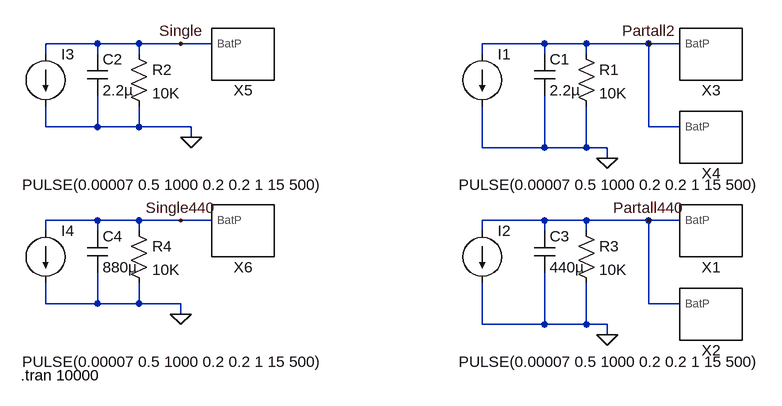
[diagram p0: schematic Battery Config.asc]
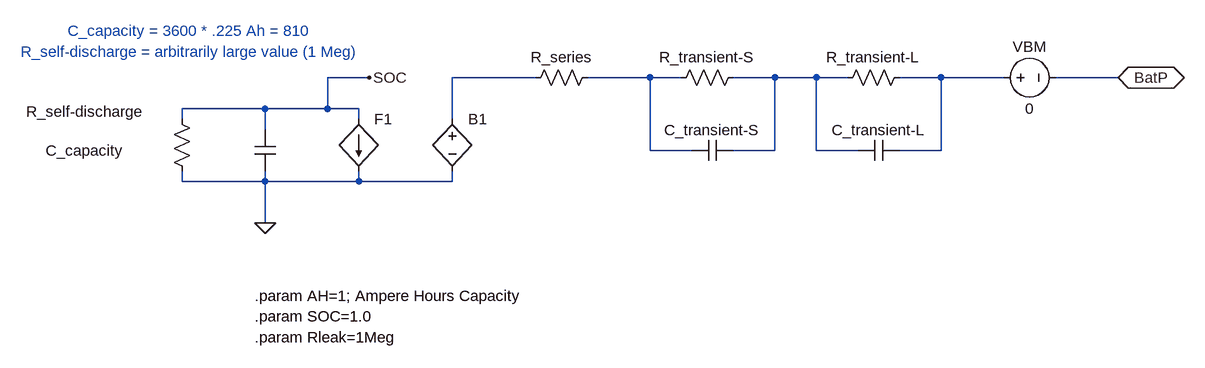
[diagram p1: sub-circuit li-battery_cr2032.asc]
Battery Config.asc, the LTspice schematic file:
Version 4
SHEET 1 1124 680
WIRE -208 96 -288 96
WIRE -144 96 -208 96
WIRE -80 96 -144 96
WIRE -32 96 -80 96
WIRE 480 96 384 96
WIRE 544 96 480 96
WIRE 640 96 544 96
WIRE 688 96 640 96
WIRE -288 112 -288 96
WIRE -208 112 -208 96
WIRE -144 112 -144 96
WIRE 384 112 384 96
WIRE 480 112 480 96
WIRE 544 112 544 96
WIRE -288 224 -288 192
WIRE -208 224 -208 176
WIRE -208 224 -288 224
WIRE -144 224 -144 192
WIRE -144 224 -208 224
WIRE -64 224 -144 224
WIRE 640 224 640 96
WIRE 688 224 640 224
WIRE -64 240 -64 224
WIRE 384 256 384 192
WIRE 480 256 480 176
WIRE 480 256 384 256
WIRE 544 256 544 192
WIRE 544 256 480 256
WIRE 576 256 544 256
WIRE 576 272 576 256
WIRE -208 368 -288 368
WIRE -144 368 -208 368
WIRE -80 368 -144 368
WIRE -32 368 -80 368
WIRE 480 368 384 368
WIRE 544 368 480 368
WIRE 640 368 544 368
WIRE 688 368 640 368
WIRE -288 384 -288 368
WIRE -208 384 -208 368
WIRE -144 384 -144 368
WIRE 384 384 384 368
WIRE 480 384 480 368
WIRE 544 384 544 368
WIRE -288 496 -288 464
WIRE -208 496 -208 448
WIRE -208 496 -288 496
WIRE -144 496 -144 464
WIRE -144 496 -208 496
WIRE -80 496 -144 496
WIRE 640 496 640 368
WIRE 688 496 640 496
WIRE -80 512 -80 496
WIRE 384 528 384 464
WIRE 480 528 480 448
WIRE 480 528 384 528
WIRE 544 528 544 464
WIRE 544 528 480 528
WIRE 576 528 544 528
WIRE 576 544 576 528
FLAG 640 96 Partall2
FLAG -80 96 Single
FLAG 640 368 Partall440
FLAG -80 368 Single440
FLAG -80 512 0
FLAG -64 240 0
FLAG 576 272 0
FLAG 576 544 0
SYMBOL Li-battery_CR2032 736 112 R180
SYMATTR InstName X3
SYMBOL Li-battery_CR2032 736 240 R180
SYMATTR InstName X4
SYMBOL Li-battery_CR2032 16 112 R180
SYMATTR InstName X5
SYMBOL load2 384 112 R0
WINDOW 3 -36 201 Left 2
WINDOW 123 0 0 Left 0
WINDOW 39 0 0 Left 0
SYMATTR InstName I1
SYMATTR Value PULSE(0.00007 0.5 1000 0.2 0.2 1 15 500)
SYMBOL res 528 96 R0
SYMATTR InstName R1
SYMATTR Value 10K
SYMBOL cap 464 112 R0
SYMATTR InstName C1
SYMATTR Value 2.2µ
SYMBOL cap -224 112 R0
SYMATTR InstName C2
SYMATTR Value 2.2µ
SYMBOL res -160 96 R0
SYMATTR InstName R2
SYMATTR Value 10K
SYMBOL Li-battery_CR2032 736 384 R180
SYMATTR InstName X1
SYMBOL Li-battery_CR2032 736 512 R180
SYMATTR InstName X2
SYMBOL load2 384 384 R0
WINDOW 3 -36 201 Left 2
WINDOW 123 0 0 Left 0
WINDOW 39 0 0 Left 0
SYMATTR InstName I2
SYMATTR Value PULSE(0.00007 0.5 1000 0.2 0.2 1 15 500)
SYMBOL res 528 368 R0
SYMATTR InstName R3
SYMATTR Value 10K
SYMBOL cap 464 384 R0
SYMATTR InstName C3
SYMATTR Value 440µ
SYMBOL load2 -288 112 R0
WINDOW 3 -36 201 Left 2
WINDOW 123 0 0 Left 0
WINDOW 39 0 0 Left 0
SYMATTR InstName I3
SYMATTR Value PULSE(0.00007 0.5 1000 0.2 0.2 1 15 500)
SYMBOL Li-battery_CR2032 16 384 R180
SYMATTR InstName X6
SYMBOL cap -224 384 R0
SYMATTR InstName C4
SYMATTR Value 880µ
SYMBOL res -160 368 R0
SYMATTR InstName R4
SYMATTR Value 10K
SYMBOL load2 -288 384 R0
WINDOW 3 -36 201 Left 2
WINDOW 123 0 0 Left 0
WINDOW 39 0 0 Left 0
SYMATTR InstName I4
SYMATTR Value PULSE(0.00007 0.5 1000 0.2 0.2 1 15 500)
TEXT -326 606 Left 2 !.tran 10000

li-battery_cr2032.asc, the sub-circuit schematic file:
Version 4
SHEET 1 1596 680
WIRE 192 48 128 48
WIRE 448 48 320 48
WIRE 624 48 528 48
WIRE 672 48 624 48
WIRE 816 48 752 48
WIRE 880 48 816 48
WIRE 928 48 880 48
WIRE 1072 48 1008 48
WIRE 1168 48 1072 48
WIRE 1344 48 1248 48
WIRE 32 96 -96 96
WIRE 128 96 128 48
WIRE 128 96 32 96
WIRE 176 96 128 96
WIRE -96 112 -96 96
WIRE 176 112 176 96
WIRE 320 112 320 48
WIRE 32 128 32 96
WIRE 624 160 624 48
WIRE 688 160 624 160
WIRE 816 160 816 48
WIRE 816 160 752 160
WIRE 880 160 880 48
WIRE 944 160 880 160
WIRE 1072 160 1072 48
WIRE 1072 160 1008 160
WIRE -96 208 -96 192
WIRE 32 208 32 192
WIRE 32 208 -96 208
WIRE 176 208 176 192
WIRE 176 208 32 208
WIRE 320 208 320 192
WIRE 320 208 176 208
WIRE 32 272 32 208
FLAG 32 272 0
FLAG 192 48 SOC
FLAG 1344 48 BatP
IOPIN 1344 48 BiDir
SYMBOL res -112 96 R0
WINDOW 0 -224 4 Left 2
WINDOW 3 37 56 Invisible 2
SYMATTR InstName R_self-discharge
SYMATTR Value R={Rleak}
SYMBOL cap 16 128 R0
WINDOW 0 -322 32 Left 2
WINDOW 3 39 24 Invisible 2
SYMATTR InstName C_capacity
SYMATTR Value {3600*.225*AH}
SYMATTR SpiceLine IC={SOC}
SYMBOL res 544 32 R90
WINDOW 0 0 56 VBottom 2
WINDOW 3 32 56 Invisible 2
SYMATTR InstName R_series
SYMATTR Value R=0.1562*exp(-24.37*V(SOC))+0.07446
SYMBOL res 768 32 R90
WINDOW 0 0 56 VBottom 2
WINDOW 3 32 56 Invisible 2
SYMATTR InstName R_transient-S
SYMATTR Value R=0.3208*exp(-29.14*V(SOC))+0.04669
SYMBOL res 1024 32 R90
WINDOW 0 0 56 VBottom 2
WINDOW 3 32 56 Invisible 2
SYMATTR InstName R_transient-L
SYMATTR Value R=6.6038*exp(-155.2*V(SOC))+0.04984
SYMBOL cap 1008 144 R90
WINDOW 0 0 32 VBottom 2
WINDOW 3 32 32 Invisible 2
SYMATTR InstName C_transient-L
SYMATTR Value Q=x*(-6056*exp(-27.12*V(SOC))+4475)
SYMBOL cap 688 176 R270
WINDOW 0 32 32 VTop 2
WINDOW 3 0 32 Invisible 2
SYMATTR InstName C_transient-S
SYMATTR Value Q=x*(-752.9*exp(-13.51*V(SOC))+703.6)
SYMBOL f 176 112 R0
WINDOW 3 24 80 Invisible 2
SYMATTR Value VBM 1
SYMATTR InstName F1
SYMBOL bv 320 96 R0
WINDOW 3 24 96 Invisible 2
SYMATTR Value V=-1.031*exp(-35*V(SOC))+3.685+0.2156*V(SOC)-0.1178*V(SOC)**2+0.3201*V(SOC)**3
SYMATTR InstName B1
SYMBOL voltage 1152 48 R270
WINDOW 0 32 56 VTop 2
WINDOW 3 -32 56 VBottom 2
SYMATTR InstName VBM
SYMATTR Value 0
TEXT -272 -24 Left 2 ;C_capacity = 3600 * .225 Ah = 810
TEXT -344 8 Left 2 ;R_self-discharge = arbitrarily large value (1 Meg)
TEXT 16 384 Left 2 !.param AH=1; Ampere Hours Capacity
TEXT 16 416 Left 2 !.param SOC=1.0
TEXT 16 448 Left 2 !.param Rleak=1Meg

The netlist it stands for:
* Battery Config.asc
XX3 Partall2 li-battery_cr2032
XX4 Partall2 li-battery_cr2032
XX5 Single li-battery_cr2032
I1 Partall2 0 PULSE(0.00007 0.5 1000 0.2 0.2 1 15 500)
R1 Partall2 0 10K
C1 Partall2 0 2.2µ
C2 Single 0 2.2µ
R2 Single 0 10K
XX1 Partall440 li-battery_cr2032
XX2 Partall440 li-battery_cr2032
I2 Partall440 0 PULSE(0.00007 0.5 1000 0.2 0.2 1 15 500)
R3 Partall440 0 10K
C3 Partall440 0 440µ
I3 Single 0 PULSE(0.00007 0.5 1000 0.2 0.2 1 15 500)
XX6 Single440 li-battery_cr2032
C4 Single440 0 880µ
R4 Single440 0 10K
I4 Single440 0 PULSE(0.00007 0.5 1000 0.2 0.2 1 15 500)

* block symbol definitions
.subckt li-battery_cr2032 BatP
R_self-discharge SOC 0 R={Rleak}
C_capacity SOC 0 {3600*.225*AH} IC={SOC}
R_series N002 N001 R=0.1562*exp(-24.37*V(SOC))+0.07446
R_transient-S N003 N002 R=0.3208*exp(-29.14*V(SOC))+0.04669
R_transient-L N004 N003 R=6.6038*exp(-155.2*V(SOC))+0.04984
C_transient-L N004 N003 Q=x*(-6056*exp(-27.12*V(SOC))+4475)
C_transient-S N002 N003 Q=x*(-752.9*exp(-13.51*V(SOC))+703.6)
F1 SOC 0 VBM 1
B1 N001 0 V=-1.031*exp(-35*V(SOC))+3.685+0.2156*V(SOC)-0.1178*V(SOC)**2+0.3201*V(SOC)**3
VBM N004 BatP 0
* C_capacity = 3600 * .225 Ah = 810
* R_self-discharge = arbitrarily large value (1 Meg)
.param AH=1; Ampere Hours Capacity
.param SOC=1.0
.param Rleak=1Meg
.ends li-battery_cr2032

.tran 10000
.backanno
.end